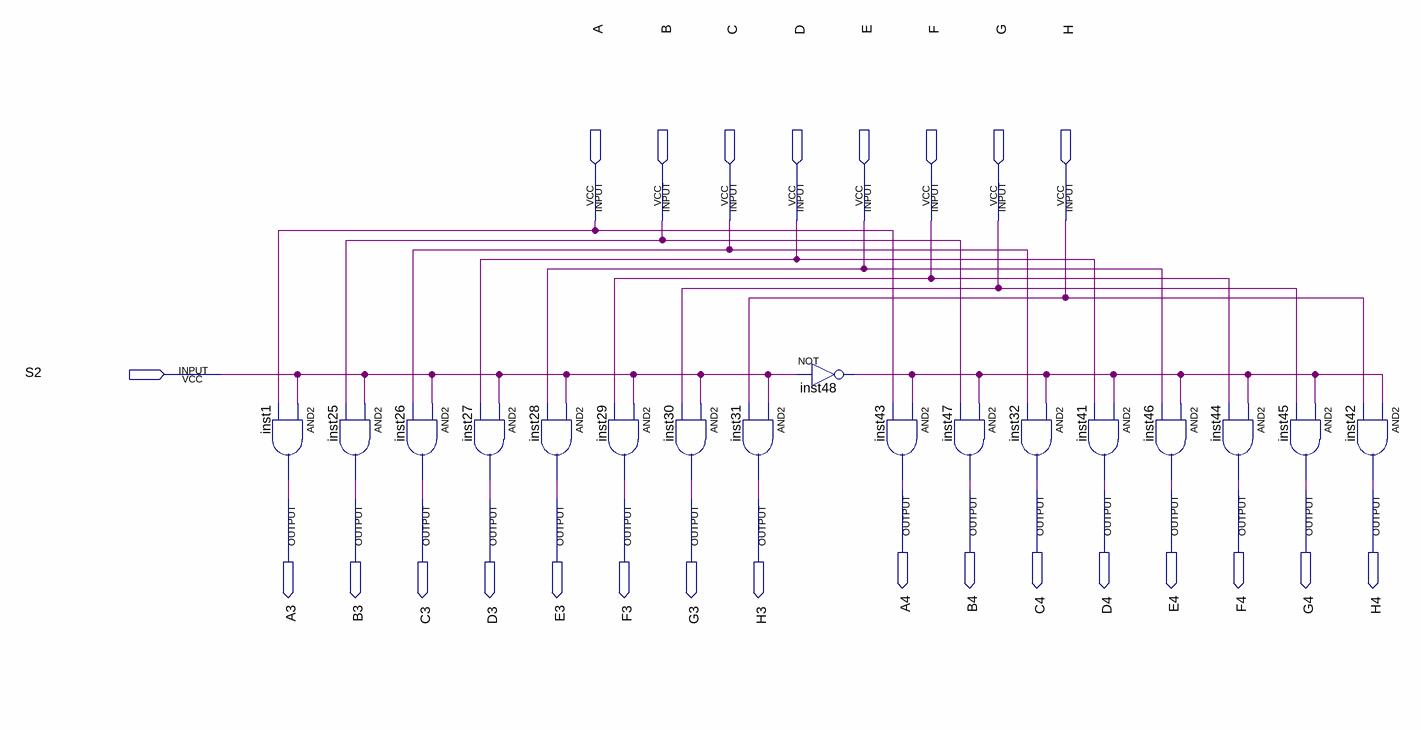
[diagram p0: schematic sheet]
// Quartus schematic Demux8x16.bdf as structural Verilog: 17 symbols, 25 pins
module Demux8x16 (
  input  A,
  input  B,
  input  C,
  input  D,
  input  E,
  input  F,
  input  G,
  input  H,
  input  S2,
  output A4,
  output B4,
  output C4,
  output D4,
  output E4,
  output F4,
  output G4,
  output H4,
  output A3,
  output B3,
  output C3,
  output D3,
  output E3,
  output F3,
  output G3,
  output H3
);

  wire inst48_out;

  and inst1 (A3, S2, A);
  and inst25 (B3, S2, B);
  and inst26 (C3, S2, C);
  and inst27 (D3, S2, D);
  and inst28 (E3, S2, E);
  and inst29 (F3, S2, F);
  and inst30 (G3, S2, G);
  not inst48 (inst48_out, S2);
  and inst31 (H3, S2, H);
  and inst43 (A4, inst48_out, A);
  and inst47 (B4, inst48_out, B);
  and inst32 (C4, inst48_out, C);
  and inst41 (D4, inst48_out, D);
  and inst46 (E4, inst48_out, E);
  and inst44 (F4, inst48_out, F);
  and inst45 (G4, inst48_out, G);
  and inst42 (H4, inst48_out, H);
endmodule
